# Altium schematic sheet TwoLayerMotorDriver.SchDoc
size A4; SheetNumber: 1; SheetTotal: 1
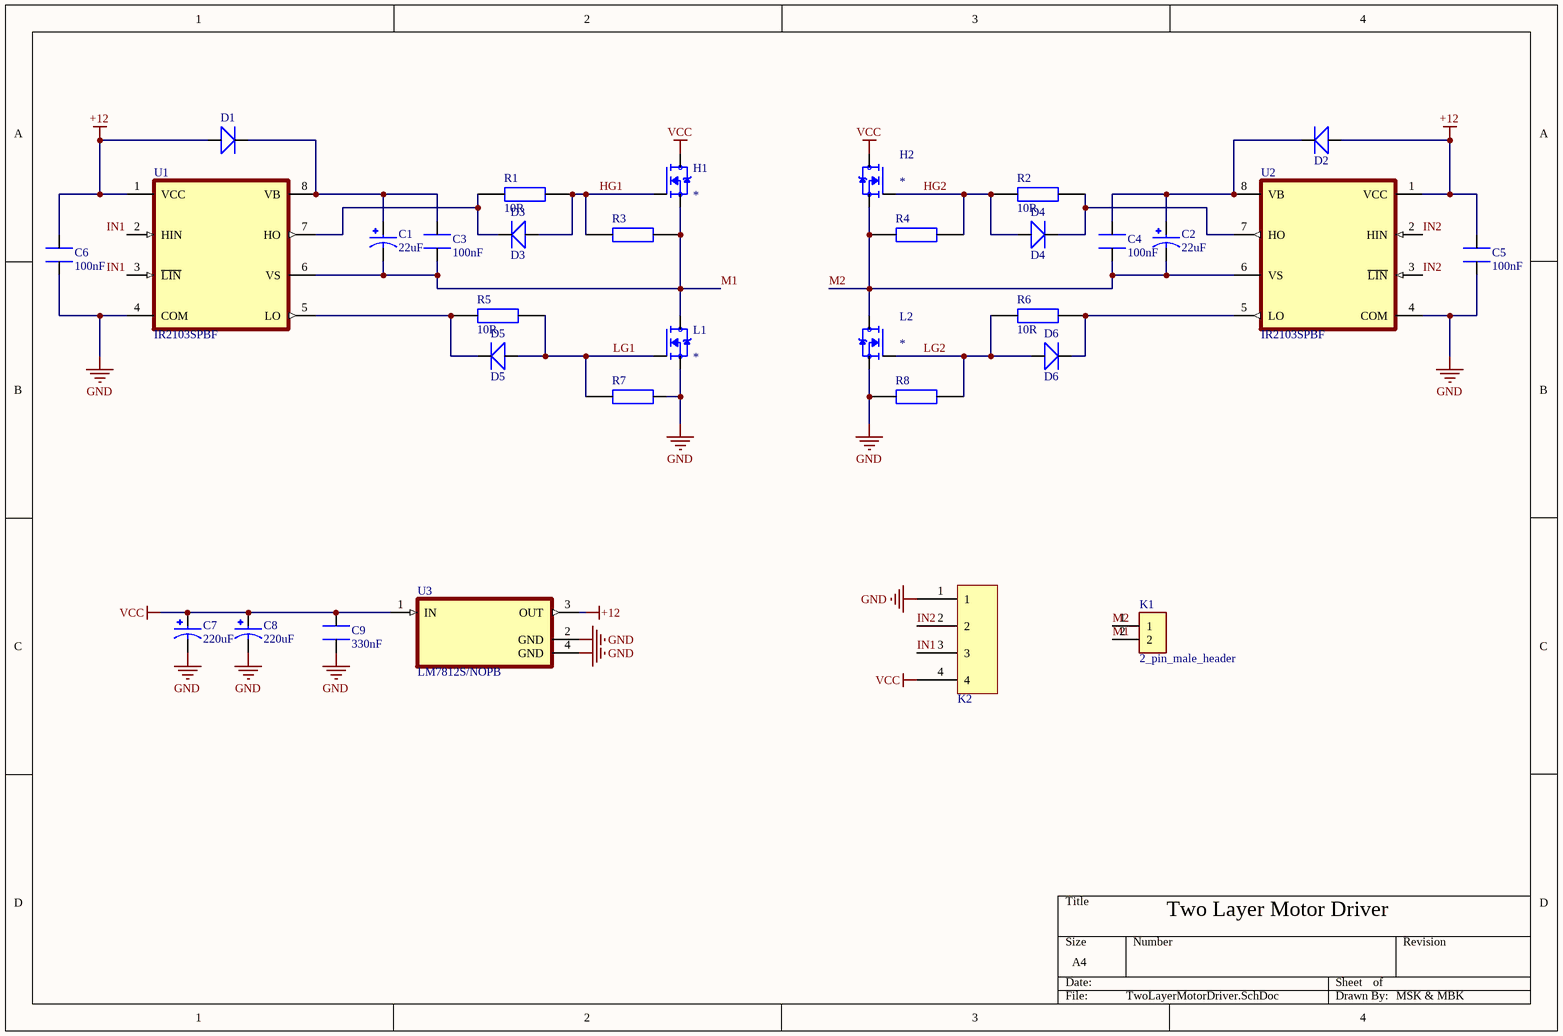
[diagram p0: TwoLayerMotorDriver.SchDoc]

## Parts
C1  22uF  [22uF-50V_CAP_EEEFN1H220UR]
C2  22uF  [22uF-50V_CAP_EEEFN1H220UR]
C3  100nF  [1206 PACKAGE]
C4  100nF  [1206 PACKAGE]
C5  100nF  [1206 PACKAGE]
C6  100nF  [1206 PACKAGE]
C7  220uF  [220uF]
C8  220uF  [220uF]
C9  330nF  [1206 PACKAGE]
D1  Diode  [FR1M-13]  (value not drawn)
D2  Diode  [FR1M-13]  (value not drawn)
D3  D3  [FR1M-13]
D4  D4  [FR1M-13]
D5  D5  [FR1M-13]
D6  D6  [FR1M-13]
H1  IRF3205S_PBF  [3205pbf]  (value not drawn)
H2  IRF3205S_PBF  [3205pbf]  (value not drawn)
K1  2_pin_male_header  [2_pin_male_header]
K2  4 Pin Klemens PCB  [4pin Terminal]  (value not drawn)
L1  IRF3205S_PBF  [3205pbf]  (value not drawn)
L2  IRF3205S_PBF  [3205pbf]  (value not drawn)
R1  10R  [1206 PACKAGE]
R2  10R  [1206 PACKAGE]
R3  CRCW12061K00FKEAHP  [1206 PACKAGE]  (value not drawn)
R4  CRCW12061K00FKEAHP  [1206 PACKAGE]  (value not drawn)
R5  10R  [1206 PACKAGE]
R6  10R  [1206 PACKAGE]
R7  CRCW12061K00FKEAHP  [1206 PACKAGE]  (value not drawn)
R8  CRCW12061K00FKEAHP  [1206 PACKAGE]  (value not drawn)
U1  IR2103SPBF  [2103SMD-8SOIC]
U2  IR2103SPBF  [2103SMD-8SOIC]
U3  LM7812S/NOPB  [lm7812]

## Nets
+12: C5.2 C6.2 D1.0 D2.0 U1.1(VCC) U2.1(VCC) U3.3(OUT)
GND: C5.1 C6.1 C7.2 C8.2 C9.2 K2.1 L1.3(S) L2.3(S) R7.2 R8.1 U1.4(COM) U2.4(COM) U3.2(GND) U3.4(GND)
VCC: C7.1 C8.1 C9.1 H1.2(D) H2.2(D) K2.4 U3.1(IN)
HG1: D3.1 H1.1(G) R1.2 R3.1
HG2: D4.1 H2.1(G) R2.1 R4.2
IN1: K2.3 U1.2(HIN) U1.3(~{LIN})
IN2: K2.2 U2.2(HIN) U2.3(~{LIN})
LG1: D5.1 L1.1(G) R5.2 R7.1
LG2: D6.1 L2.1(G) R6.1 R8.2
M1: C1.2 C3.1 H1.3(S) K1.2 L1.2(D) R3.2 U1.6(VS)
M2: C2.2 C4.1 H2.3(S) K1.1 L2.2(D) R4.1 U2.6(VS)
NetC1_1: C1.1 C3.2 D1.1 U1.8(VB)
NetC2_1: C2.1 C4.2 D2.1 U2.8(VB)
NetD3_2: D3.2 R1.1 U1.7(HO)
NetD4_2: D4.2 R2.2 U2.7(HO)
NetD5_2: D5.2 R5.1 U1.5(LO)
NetD6_2: D6.2 R6.2 U2.5(LO)

## Notes on the sheet
- Two Layer Motor Driver
- MSK & MBK

## Library data of the parts
C1 C2 = 22uF: CAP ALUM 22UF 20% 50V SMD; Urun kodu: EEEFN1H220UR; MF: Panasonic Electronic Components; MP: EEE-FN1H220UR; SnapEDA_Link: https://www.snapeda.com/parts/EEE-FN1H220UR/Panasonic/view-part/6178088/?ref=snap; Check_prices: https://www.snapeda.com/parts/EEE-FN1H220UR/Panasonic/view-part/6178088/?ref=eda; Purchase-URL: https://pricing.snapeda.com/search/part/EEE-FN1H220UR/?ref=eda; Price: None; Availability: In Stock; Package: RADIAL-2 Panasonic
C3-C6 = 100nF 50V SERAMIC CAPACITOR
C7 C8 = 220uF: CAP ALUM 220UF 20% 50V SMD; MF: Panasonic; Urun adi: EEEFP1H221AL; Check_prices: https://www.snapeda.com/parts/EEEFP1H221AL/Panasonic/view-part/5797279/?ref=eda; SnapEDA_Link: https://www.snapeda.com/parts/EEEFP1H221AL/Panasonic/view-part/5797279/?ref=snap; Availability: In Stock; Price: None; MP: EEEFP1H221AL; Package: RADIAL-2 Panasonic
C9 = 330nF: 330nF 50V seramic capacitor 1206 package
D1 D2 = FR1MDITR DIODE: Diode Standard 1000 V 1A Surface Mount SMB / https://www.digikey.si/en/products/detail/diodes-incorporated/FR1M-13/743555; part number: FR1MDITR-ND; manufacturer product number: FR1M-13
D3-D6 = DIODE: Diode Standard 1000 V 1A Surface Mount SMB / https://www.digikey.si/en/products/detail/diodes-incorporated/FR1M-13/743555
H1 H2 L1 L2 = IRF3205S_PBF: RoHS Compliant | Low RDS_on_ | Industry-leading quality | Dynamic dv/dt Rating | Fast Switching | Fully Avalanche Rated | 175C Operating Temperature; MF: Infineon Technologies; MP: IRF3205SPBF; Package: D2PAK Infineon; Price: None; SnapEDA_Link: https://www.snapeda.com/parts/IRF3205SPBF/Infineon%20Technologies/view-part/576468/?ref=snap; Availability: Unavailable; Value: *
K1 = 2_pin_male_header: TERM BLOCK 5.08MM 2POS SIDE ENTY; MP: 282837-2; Value: *; Availability: Unavailable; Price: None; Package: None
K2 = 4 Pin Klemens PCB: Designed By: Bora
R1 R2 R5 R6 = 10 1/4W: 10R 1/4W 1206 RESISTOR_1 CRCW Power Resistor 1206 0.5W 1K 1% Vishay CRCW Series Thick Film High Power Surface Mount Resistor 1206 Case 1k +/-1% 0.5W +/-100ppm/K; Manufacturer_Part_Number: CRCW12061K00FKEAHP; Geometry.Height: 0.65mm; Mouser Part Number: 71-CRCW12061K00FKEAH; Mouser Price/Stock: https://www.mouser.co.uk/ProductDetail/Vishay-Dale/CRCW12061K00FKEAHP?qs=AuiXZzjRd4VaQJAN1hHm0g%3D%3D; Manufacturer_Name: Vishay; Datasheet Link: http://componentsearchengine.com/Datasheets/1/CRCW12061K00FKEAHP.pdf
R3 R4 R7 R8 = 1K 1/4W: 1K 1/4W 1206 RESISTOR       CRCW Power Resistor 1206 0.5W 1K 1% Vishay CRCW Series Thick Film High Power Surface Mount Resistor 1206 Case 1k +/-1% 0.5W +/-100ppm/K; Geometry.Height: 0.65mm; Mouser Part Number: 71-CRCW12061K00FKEAH; Mouser Price/Stock: https://www.mouser.co.uk/ProductDetail/Vishay-Dale/CRCW12061K00FKEAHP?qs=AuiXZzjRd4VaQJAN1hHm0g%3D%3D; Manufacturer_Name: Vishay; Manufacturer_Part_Number: CRCW12061K00FKEAHP; Datasheet Link: http://componentsearchengine.com/Datasheets/1/CRCW12061K00FKEAHP.pdf
U1 U2 = IR2103SPBF: Floating channel designed for bootstrap operation | Fully operational to +600 V | Tolerant to negative transient voltage | dV/dt immune | Gate drive supply range from 10 to 20 V | Undervoltage lockout | 3.3 V, 5 V, and 15 V logic input compatible | Cross-conduction prevention logic | Matched propagation delay for both channels | Internal set deadtime | High side output in phase with HIN input | Low side output out of phase with LIN input; MF: Infineon; Price: None; SnapEDA_Link: https://www.snapeda.com/parts/IR2103SPBF/Infineon%20Technologies/view-part/576530/?ref=snap; MP: IR2103SPBF; Availability: Unavailable; Package: SOIC-8 Infineon
U3 = LM7812S/NOPB: 1.5-A, 30-V, linear voltage regulator 3-DDPAK/TO-263 0 to 125; MF: Texas Instruments; Mouser-Purchase-URL: https://snapeda.com/shop?store=Mouser&id=559615; Value: *; Arrow_Electronics-Purchase-URL: https://snapeda.com/shop?store=Arrow+Electronics&id=559615; Price: None; Availability: Unavailable; DigiKey-Purchase-URL: https://snapeda.com/shop?store=DigiKey&id=559615; Texas_Instruments-Purchase-URL: https://snapeda.com/shop?store=Texas+Instruments&id=559615; SnapEDA_Link: https://www.snapeda.com/parts/LM7812S/NOPB/Texas%20Instruments/view-part/559615/?ref=snap; Package: TO-263-3 Texas Instruments; MP: LM7812S/NOPB